# Altium schematic sheet Solar Battery Charger.SchDoc
size A; SheetNumber: 1; SheetTotal: 1
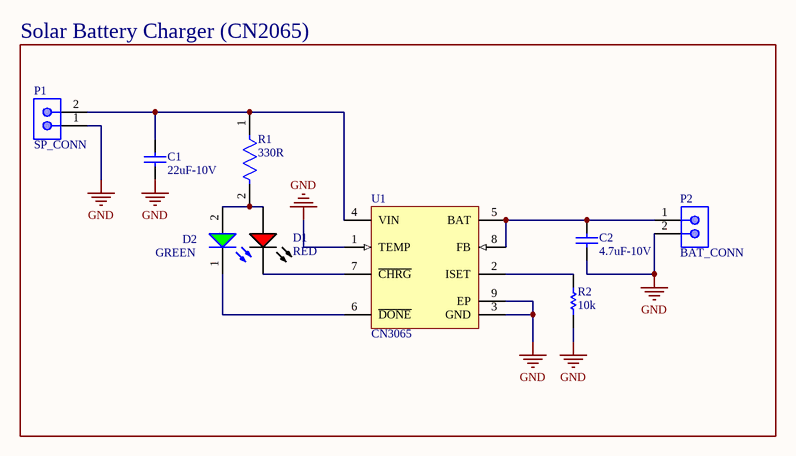
[diagram p0: Solar Battery Charger.SchDoc]

## Parts
C1  22uF-10V  [CAPC2013X95X45ML15T25]
C2  4.7uF-10V  [CAPC2013X95X45LL10T25]
D1  RED  [AVAG-HSMX-C190_V]
D2  GREEN  [WL-SMCW_0603_150060xx75000]
P1  SP_CONN  [MOLX-22-23-2021_V]
P2  BAT_CONN  [MOLX-22-23-2021_V]
R1  330R  [FP-CRCW0603-e3-MFG]
R2  10k  [RESC2013X60X35NL10T20]
U1  CN3065  [CONS-DFN-8_M]

## Blocks framed on the sheet
Solar Battery Charger (CN2065): C1 C2 D1 D2 P1 P2 R1 R2 U1

## Nets
GND: C1.1 C2.2 P1.1 P2.2 R2.2 U1.1(TEMP) U1.3(GND) U1.9(EP)
NetC1_2: C1.2 P1.2 R1.1 U1.4(VIN)
NetC2_1: C2.1 P2.1 U1.5(BAT) U1.8(FB)
NetD1_1: D1.1(A) D2.2(A) R1.2
NetD1_2: D1.2(K) U1.7(~{CHRG})
NetD2_1: D2.1(K) U1.6(~{DONE})
NetR2_1: R2.1 U1.2(ISET)

## Library data of the parts
C1 = CMP-2007-00096-1: Manufacturer: Murata; Part Number: GRM219R61A226MEA0D
C2 = CMP-2007-00114-1: Manufacturer: Murata; Part Number: GRM219R61A475KE34J
D1 = CMP-1744-00004-1: LED Uni-Color Red, 65 mW, 20 mA, -40 to 85 degC, 2-Pin SMD, RoHS, Tape and Reel; Connector Type: USB; Gender: Male; Current Rating: 1 A; Length: 7.5 mm; Lead Pitch: 0.65 mm; PackageReference: HSMX-C190; Package Quantity: 2000; Max Operating Temperature: 85 degC; PackageDescription: 2-Pin Surface Mount Device, Body 1.6 x 0.8 mm, Height 0.9 mm; ComponentLink3Description: Package Specification; Mount: Surface Mount; Min Operating Temperature: -30 degC; ComponentLink3URL: http://www.fairchildsemi.com/dwg/MA/MA03D.pdf; ComponentLink1Description: Manufacturer URL; Contact Material: Copper; Pins: 5; Width: 5.6 mm; ComponentLink2Description: Datasheet; RoHSCompliant: true; DatasheetVersion: Mar-12; Height: 2.8 mm; Packaging: Tape and Reel; Contact Plating: Gold; ComponentLink1URL: http://www.avagotech.com/; REACH SVHC: No SVHC; ComponentLink2URL: http://docs.avagotech.com/docs/AV02-0551EN
D2 = CMP-1426-00006-7: WURTH ELEKTRONIK - 150060VS75000 - LED, Green, SMD, 0603, 30 mA, 2 V, 570 nm; Reverse Voltage: 5V; Power Dissipation: 72mW; Dominant Wavelength: 570nm; Peak Wavelength: 572nm; Forward Current: 100mA; Forward Voltage: 2V; Lens Style: Clear, Rectangular; Test Current: 20mA; Max Junction Temperature (Tj): 95°C; Viewing Angle: 140°; Luminous Intensity: 40mcd; Height: 700µm; Width: 800µm; Length: 1.6mm; Mount: Surface Mount; Min Operating Temperature: -40°C; Max Reverse Voltage (DC): 5V; Case Code (Imperial): 0603; Wavelength: 570nm; Color: Green; REACH SVHC: Unknown; RoHS: Compliant; Max Operating Temperature: 85°C; Packaging: Tape and Reel; Case/Package: 0603; Number of Pins: 2; Case Code (Metric): 1608
P1 P2 = CMP-1704-00001-3: Male Header, Pitch 2.54 mm, 1 x 2 Position, Height 10.67 mm, Tail Length 3.56 mm, 0 to 75 degC, RoHS, Bulk; Package Quantity: 3000; Height: 10.67 mm; RoHSCompliant: True; ComponentLink2URL: https://datasheet.ciiva.com/19454/232266-19454304.pdf; PartNumber: 22-23-2021; Packaging: Bulk; ComponentLink2Description: Datasheet; Min Operating Temperature: 0 degC; ComponentLink1Description: Manufacturer URL; Length: 5.08 mm; Mounting Technology: Through Hole; Max Operating Temperature: 75 degC; REACH SVHC: Unknown; PackageDescription: Male Header, Pitch 2.54 mm, 1 x 2 Position, Height 10.67 mm, Tail Length 3.56 mm; ComponentLink1URL: http://www.molex.com/; Mount: Through Hole; Radiation Hardening: No; Width: 6.35 mm; Pins: 2
R1 = CMP-1012-00454-3: RES Thick Film, 330Ω, 1%, 0.1W, 100ppm/°C, 0603; Voltage Rating: 75V; Max Power Dissipation: 100mW; Depth: 0.85mm; Contact Plating: Tin; Package Quantity: 10; Termination: SMD/SMT; Tolerance: 1%; Height: 0.45mm; Number of Terminations: 2; Radiation Hardening: No; Features: Automotive AEC-Q200; Case/Package: 0603; Mount: Surface Mount; Case Code (Metric): 1608; Lead Free: Lead Free; Temperature Coefficient: 100ppm/°C; Weight: 7.1E-05oz; Military Standard: Not; Packaging: Tape and Reel; Max Operating Temperature: 155°C; Voltage Rating (DC): 75V; Length: 1.55mm; Resistance: 330R; Min Operating Temperature: -55°C; Composition: Thick Film; Case Code (Imperial): 0603; Width: 0.033inch; Power Rating: 100mW
R2 = CMP-1659-00013-4: Chip Resistor, 10 KOhm, +/- 1%, 0.125 W, -55 to 155 degC, 0805 (2012 Metric), RoHS, Tape and Reel; Manufacturer: Yageo; Voltage Rating: 150 V; Mount: Surface Mount; ComponentLink1Description: Manufacturer URL; ComponentLink2URL: http://www.yageo.com/documents/recent/PYu-RC_Group_51_RoHS_L_04.pdf; Pins: 2; Length: 2 mm; Min Operating Temperature: -55 degC; Height: 0.5 mm; Mounting Technology: Surface Mount; RoHSCompliant: true; REACH SVHC: No SVHC; ComponentLink1URL: http://www.yageo.com/; Max Operating Temperature: 155 degC; PackageReference: 0805; DatasheetVersion: Rev. 4, 02/2016; Package Quantity: 5000; Packaging: Tape and Reel; ComponentLink2Description: Datasheet; PackageDescription: 2-Pin Surface Mounted Device, Body 2 x 1.25 mm
U1 = CMP-2100-03613-1: Lithium Ion Battery Charger for Solar-Powered Systems, 4.4 to 6 V, 650 uA, -40 to 85 degC, 8-Pin DFN, RoHS; Manufacturer: Consonance Electronic; Package Reference: DFN-8; Datasheet Version: Rev. 1.0, 09/2009; Datasheet URL: http://www.consonance-elec.com/pdf/datasheet/DSE-CN3065.pdf; Manufacturer URL: http://www.consonance-elec.com/; Package Description: 8-Pin Small Outline No-lead Package, Body 3 x 3 mm, Pitch 0.5 mm